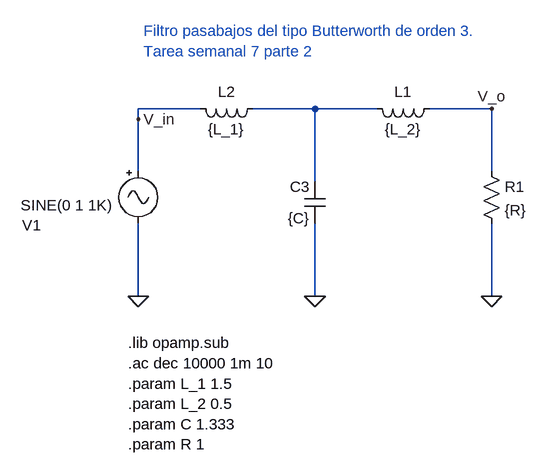
[diagram p0: schematic butter.asc]
butter.asc, the LTspice schematic file:
Version 4
SHEET 1 1780 1008
WIRE 496 304 400 304
WIRE 672 304 576 304
WIRE 768 304 672 304
WIRE 944 304 848 304
WIRE 400 320 400 304
WIRE 400 400 400 320
WIRE 944 400 944 304
WIRE 672 416 672 304
WIRE 400 592 400 480
WIRE 672 592 672 480
WIRE 944 592 944 480
FLAG 400 592 0
FLAG 400 320 V_in
FLAG 944 592 0
FLAG 672 592 0
FLAG 944 304 V_o
SYMBOL Misc/signal 400 384 R0
WINDOW 0 -179 99 Left 2
WINDOW 3 -181 68 Left 2
SYMATTR InstName V1
SYMATTR Value2 AC 1
SYMBOL cap 688 480 R180
WINDOW 0 24 56 Left 2
WINDOW 3 24 8 Left 2
SYMATTR InstName C3
SYMATTR Value {C}
SYMBOL res 928 384 R0
SYMATTR InstName R1
SYMATTR Value {R}
SYMBOL ind 864 288 R90
WINDOW 0 5 56 VBottom 2
WINDOW 3 32 56 VTop 2
SYMATTR InstName L1
SYMATTR Value {L_2}
SYMBOL ind 592 288 R90
WINDOW 0 5 56 VBottom 2
WINDOW 3 32 56 VTop 2
SYMATTR InstName L2
SYMATTR Value {L_1}
TEXT 384 664 Left 2 !.lib opamp.sub\n.ac dec 10000 1m 10\n.param L_1 1.5\n.param L_2 0.5\n.param C 1.333\n.param R 1
TEXT 408 184 Left 2 ;Filtro pasabajos del tipo Butterworth de orden 3.\nTarea semanal 7 parte 2

The netlist it stands for:
* butter.asc
V1 V_in 0 SINE(0 1 1K) AC 1
C3 0 N001 {C}
R1 V_o 0 {R}
L1 V_o N001 {L_2}
L2 N001 V_in {L_1}
.lib opamp.sub
.ac dec 10000 1m 10
.param L_1 1.5
.param L_2 0.5
.param C 1.333
.param R 1
* Filtro pasabajos del tipo Butterworth de orden 3.
* Tarea semanal 7 parte 2
.backanno
.end